# EAGLE schematic Verdrahtungsplan (EAGLE 9.6.0)
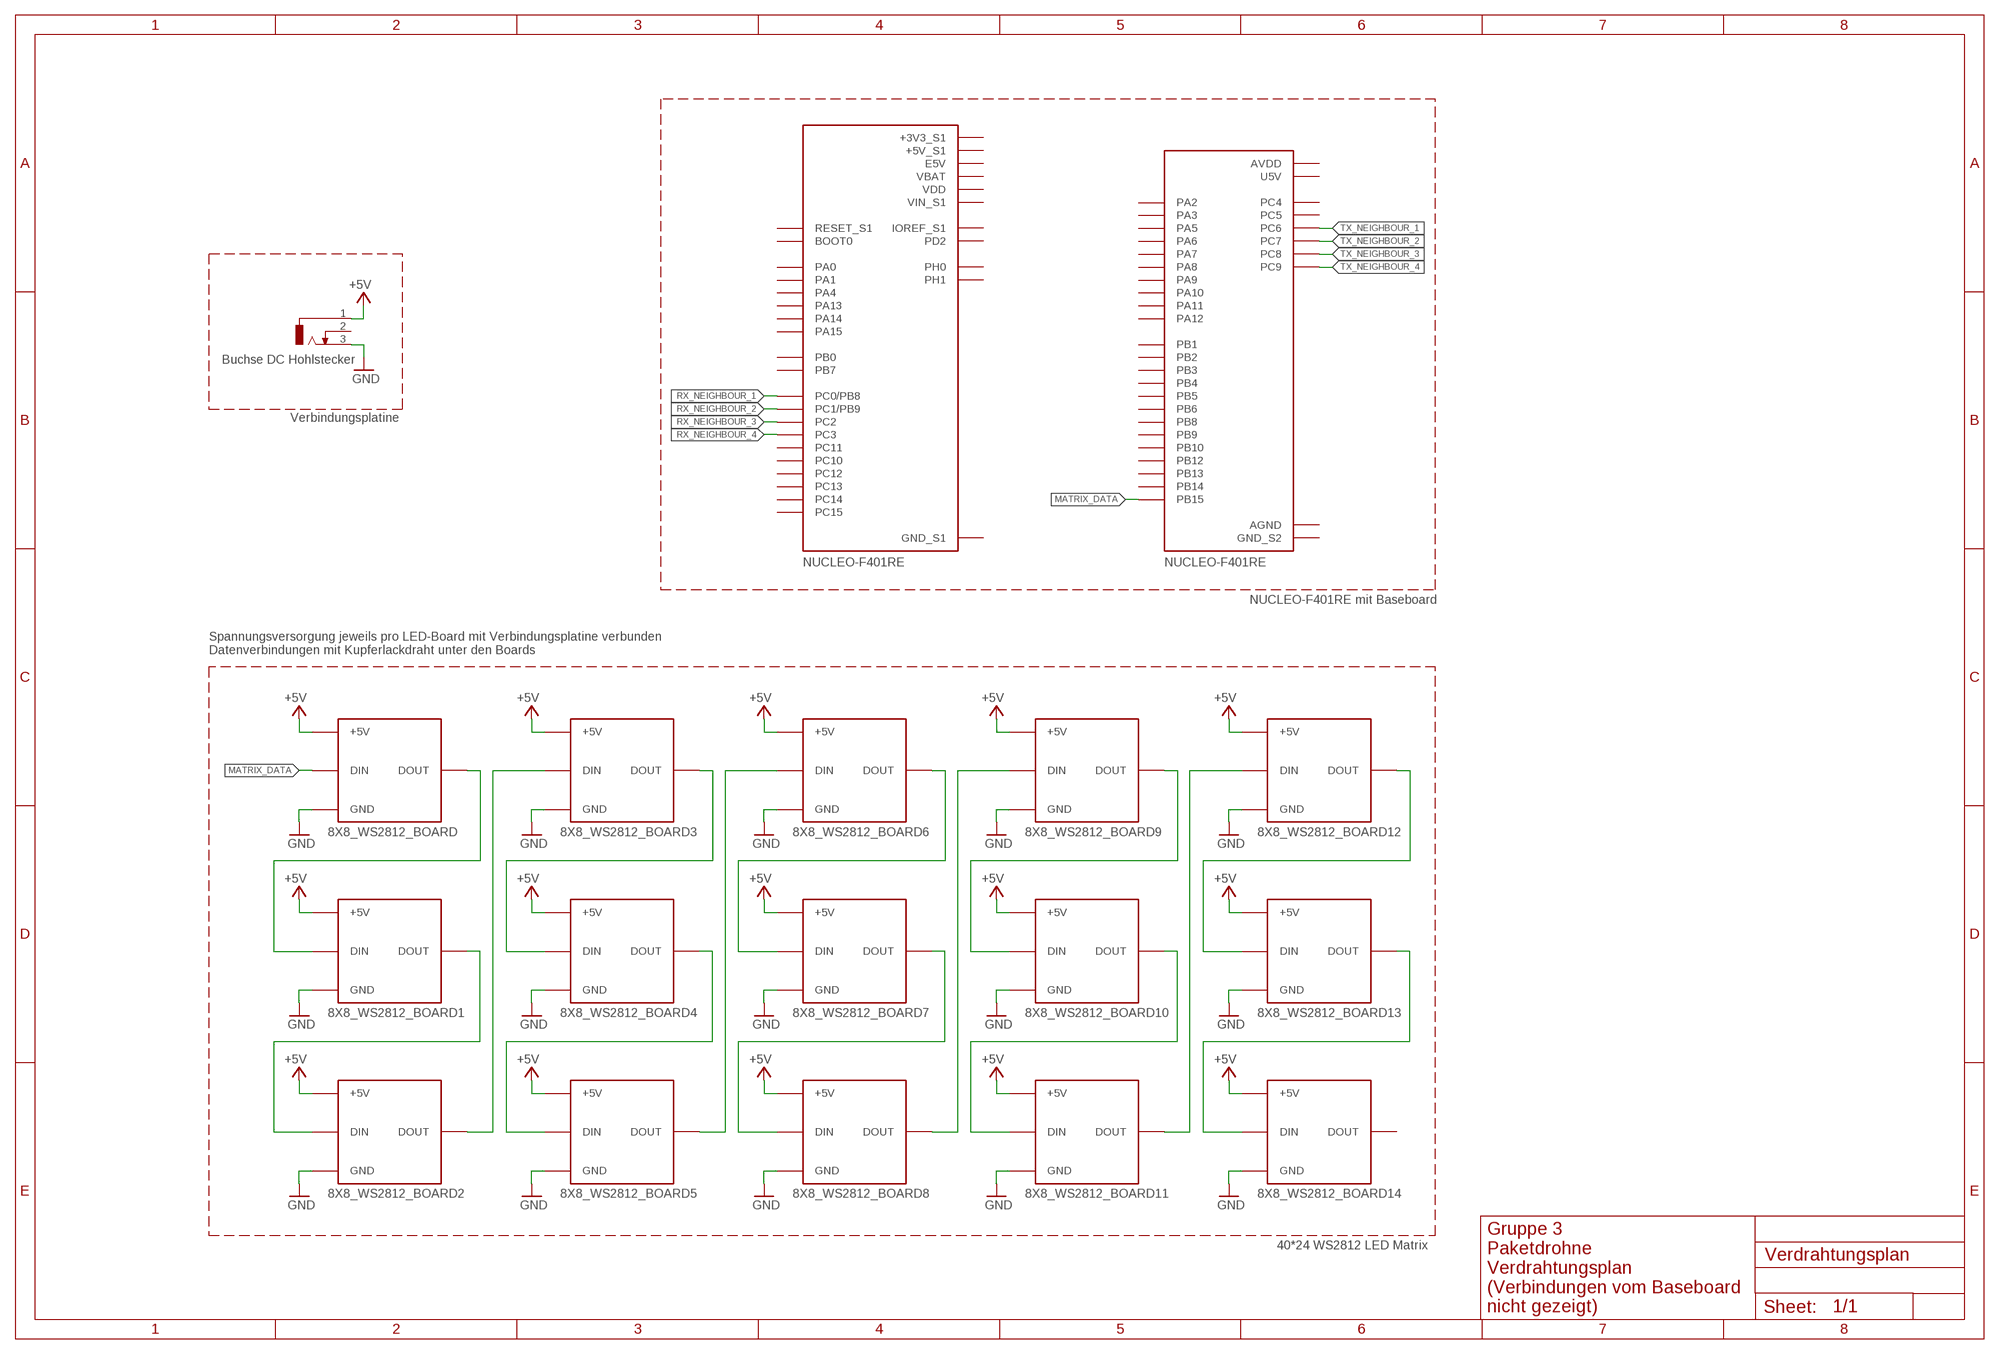
[diagram p0: schematic, sheet 1]

## Parts
8X8_WS2812_BOARD  LED_BOARD  [LEDS]
8X8_WS2812_BOARD1  LED_BOARD  [LEDS]
8X8_WS2812_BOARD2  LED_BOARD  [LEDS]
8X8_WS2812_BOARD3  LED_BOARD  [LEDS]
8X8_WS2812_BOARD4  LED_BOARD  [LEDS]
8X8_WS2812_BOARD5  LED_BOARD  [LEDS]
8X8_WS2812_BOARD6  LED_BOARD  [LEDS]
8X8_WS2812_BOARD7  LED_BOARD  [LEDS]
8X8_WS2812_BOARD8  LED_BOARD  [LEDS]
8X8_WS2812_BOARD9  LED_BOARD  [LEDS]
8X8_WS2812_BOARD10  LED_BOARD  [LEDS]
8X8_WS2812_BOARD11  LED_BOARD  [LEDS]
8X8_WS2812_BOARD12  LED_BOARD  [LEDS]
8X8_WS2812_BOARD13  LED_BOARD  [LEDS]
8X8_WS2812_BOARD14  LED_BOARD  [LEDS]
J1  Buchse DC Hohlstecker  DCJ0202  [DCJ0202]
U1  NUCLEO-F401RE  [ST_NUCLEO-F401RE]

## Nets
+5V: 8X8_WS2812_BOARD1.P$1(+5V) 8X8_WS2812_BOARD2.P$1(+5V) 8X8_WS2812_BOARD3.P$1(+5V) 8X8_WS2812_BOARD4.P$1(+5V) 8X8_WS2812_BOARD5.P$1(+5V) 8X8_WS2812_BOARD6.P$1(+5V) 8X8_WS2812_BOARD7.P$1(+5V) 8X8_WS2812_BOARD8.P$1(+5V) 8X8_WS2812_BOARD9.P$1(+5V) 8X8_WS2812_BOARD10.P$1(+5V) 8X8_WS2812_BOARD11.P$1(+5V) 8X8_WS2812_BOARD12.P$1(+5V) 8X8_WS2812_BOARD13.P$1(+5V) 8X8_WS2812_BOARD14.P$1(+5V) 8X8_WS2812_BOARD.P$1(+5V) J1.1
GND: 8X8_WS2812_BOARD1.P$4(GND) 8X8_WS2812_BOARD2.P$4(GND) 8X8_WS2812_BOARD3.P$4(GND) 8X8_WS2812_BOARD4.P$4(GND) 8X8_WS2812_BOARD5.P$4(GND) 8X8_WS2812_BOARD6.P$4(GND) 8X8_WS2812_BOARD7.P$4(GND) 8X8_WS2812_BOARD8.P$4(GND) 8X8_WS2812_BOARD9.P$4(GND) 8X8_WS2812_BOARD10.P$4(GND) 8X8_WS2812_BOARD11.P$4(GND) 8X8_WS2812_BOARD12.P$4(GND) 8X8_WS2812_BOARD13.P$4(GND) 8X8_WS2812_BOARD14.P$4(GND) 8X8_WS2812_BOARD.P$4(GND) J1.3
MATRIX_DATA: 8X8_WS2812_BOARD1.P$2(DIN) 8X8_WS2812_BOARD2.P$3(DOUT) 8X8_WS2812_BOARD3.P$2(DIN) 8X8_WS2812_BOARD3.P$3(DOUT) 8X8_WS2812_BOARD4.P$2(DIN) 8X8_WS2812_BOARD.P$2(DIN) 8X8_WS2812_BOARD.P$3(DOUT) U1.CN10_26(PB15)
MATRIX_DATA1: 8X8_WS2812_BOARD1.P$3(DOUT) 8X8_WS2812_BOARD2.P$2(DIN)
MATRIX_DATA2: 8X8_WS2812_BOARD4.P$3(DOUT) 8X8_WS2812_BOARD5.P$2(DIN)
MATRIX_DATA3: 8X8_WS2812_BOARD5.P$3(DOUT) 8X8_WS2812_BOARD6.P$2(DIN) 8X8_WS2812_BOARD6.P$3(DOUT) 8X8_WS2812_BOARD7.P$2(DIN)
MATRIX_DATA4: 8X8_WS2812_BOARD7.P$3(DOUT) 8X8_WS2812_BOARD8.P$2(DIN)
MATRIX_DATA5: 8X8_WS2812_BOARD8.P$3(DOUT) 8X8_WS2812_BOARD9.P$2(DIN) 8X8_WS2812_BOARD9.P$3(DOUT) 8X8_WS2812_BOARD10.P$2(DIN)
MATRIX_DATA6: 8X8_WS2812_BOARD10.P$3(DOUT) 8X8_WS2812_BOARD11.P$2(DIN)
MATRIX_DATA7: 8X8_WS2812_BOARD11.P$3(DOUT) 8X8_WS2812_BOARD12.P$2(DIN) 8X8_WS2812_BOARD12.P$3(DOUT) 8X8_WS2812_BOARD13.P$2(DIN)
MATRIX_DATA8: 8X8_WS2812_BOARD13.P$3(DOUT) 8X8_WS2812_BOARD14.P$2(DIN)
RX_NEIGHBOUR_1: U1.CN7_38(PC0/PB8)
RX_NEIGHBOUR_2: U1.CN7_36(PC1/PB9)
RX_NEIGHBOUR_3: U1.CN7_35(PC2)
RX_NEIGHBOUR_4: U1.CN7_37(PC3)
TX_NEIGHBOUR_1: U1.CN10_4(PC6)
TX_NEIGHBOUR_2: U1.CN10_19(PC7)
TX_NEIGHBOUR_3: U1.CN10_2(PC8)
TX_NEIGHBOUR_4: U1.CN10_1(PC9)
Unconnected: 8X8_WS2812_BOARD14.P$3(DOUT) J1.2 U1.CN5_1(D8) U1.CN5_2(D9) U1.CN5_3(D10) U1.CN5_4(D11) U1.CN5_5(D12) U1.CN5_6(D13) U1.CN5_9(D14) U1.CN5_10(D15) U1.CN6_2(IOREF) U1.CN6_3(RESET) U1.CN7_1(PC10) U1.CN7_2(PC11) U1.CN7_3(PC12) U1.CN7_4(PD2) U1.CN7_7(BOOT0) U1.CN7_12(IOREF_S1) U1.CN7_13(PA13) U1.CN7_14(RESET_S1) U1.CN7_15(PA14) U1.CN7_17(PA15) U1.CN7_21(PB7) U1.CN7_23(PC13) U1.CN7_25(PC14) U1.CN7_27(PC15) U1.CN7_28(PA0) U1.CN7_29(PH0) U1.CN7_30(PA1) U1.CN7_31(PH1) U1.CN7_32(PA4) U1.CN7_34(PB0) U1.CN8_1(A0) U1.CN8_2(A1) U1.CN8_3(A2) U1.CN8_4(A3) U1.CN8_5(A4) U1.CN8_6(A5) U1.CN9_1(D0) U1.CN9_2(D1) U1.CN9_3(D2) U1.CN9_4(D3) U1.CN9_5(D4) U1.CN9_6(D5) U1.CN9_7(D6) U1.CN9_8(D7) U1.CN10_3(PB8) U1.CN10_5(PB9) U1.CN10_6(PC5) U1.CN10_11(PA5) U1.CN10_12(PA12) U1.CN10_13(PA6) U1.CN10_14(PA11) U1.CN10_15(PA7) U1.CN10_16(PB12) U1.CN10_17(PB6) U1.CN10_21(PA9) U1.CN10_22(PB2) U1.CN10_23(PA8) U1.CN10_24(PB1) U1.CN10_25(PB10) U1.CN10_27(PB4) U1.CN10_28(PB14) U1.CN10_29(PB5) U1.CN10_30(PB13) U1.CN10_31(PB3) U1.CN10_33(PA10) U1.CN10_34(PC4) U1.CN10_35(PA2) U1.CN10_37(PA3)

## Notes on the sheet
- Verbindungsplatine
- NUCLEO-F401RE mit Baseboard
- Spannungsversorgung jeweils pro LED-Board mit Verbindungsplatine verbunden
  Datenverbindungen mit Kupferlackdraht unter den Boards
- 40*24 WS2812 LED Matrix
- Gruppe 3
  Paketdrohne
  Verdrahtungsplan
  (Verbindungen vom Baseboard 
  nicht gezeigt)

## Power pins joined to a net without a drawn wire
+3V3: U1.CN6_4(+3V3)
+3V3_S1: U1.CN7_16(+3V3_S1)
+5V: U1.CN6_5(+5V)
+5V_S1: U1.CN7_18(+5V_S1)
AGND: U1.CN10_32(AGND)
AREF: U1.CN5_8(AREF)
AVDD: U1.CN10_7(AVDD)
E5V: U1.CN7_6(E5V)
GND: U1.CN6_6(GND) U1.CN6_7(GND)
GND_S1: U1.CN7_8(GND_S1) U1.CN7_19(GND_S1) U1.CN7_20(GND_S1) U1.CN7_22(GND_S1)
GND_S2: U1.CN10_9(GND_S2) U1.CN10_20(GND_S2)
GND_S6: U1.CN5_7(GND_S6)
U5V: U1.CN10_8(U5V)
VBAT: U1.CN7_33(VBAT)
VDD: U1.CN7_5(VDD)
VIN: U1.CN6_8(VIN)
VIN_S1: U1.CN7_24(VIN_S1)

## Library data of the parts
8X8_WS2812_BOARD 8X8_WS2812_BOARD1-8X8_WS2812_BOARD14 = EmbeddedSystems:LED_BOARD
J1 = con-jack:DCJ0202: DC POWER JACK Source: DCJ0202.pdf; OC_FARNELL: unknown; OC_NEWARK: unknown
U1 = NUCLEO-F401RE:NUCLEO-F401RE: STM32 Nucleo-64 development board with STM32F401RET6 MCU, supports Arduino and ST morpho connectivity Check availability <https://pricing.snapeda.com/parts/NUCLEO-F401RE/STMicroelectronics/view-part?ref=eda>; AVAILABILITY: In Stock; CHECK_PRICES: https://www.snapeda.com/parts/NUCLEO-F401RE/STMicroelectronics/view-part/?ref=eda; DESCRIPTION: STM32F401RE, mbed-Enabled Development Nucleo-64 STM32F4 ARM® Cortex®-M4 MCU 32-Bit Embedded Evaluation Board; MF: STMicroelectronics; MP: NUCLEO-F401RE; PACKAGE: None; PRICE: None; PURCHASE-URL: https://www.snapeda.com/api/url_track_click_mouser/?unipart_id=329267&manufacturer=STMicroelectronics&part_name=NUCLEO-F401RE&search_term=None; SNAPEDA_LINK: https://www.snapeda.com/parts/NUCLEO-F401RE/STMicroelectronics/view-part/?ref=snap